# EAGLE design A131B (EAGLE 6.6.0)
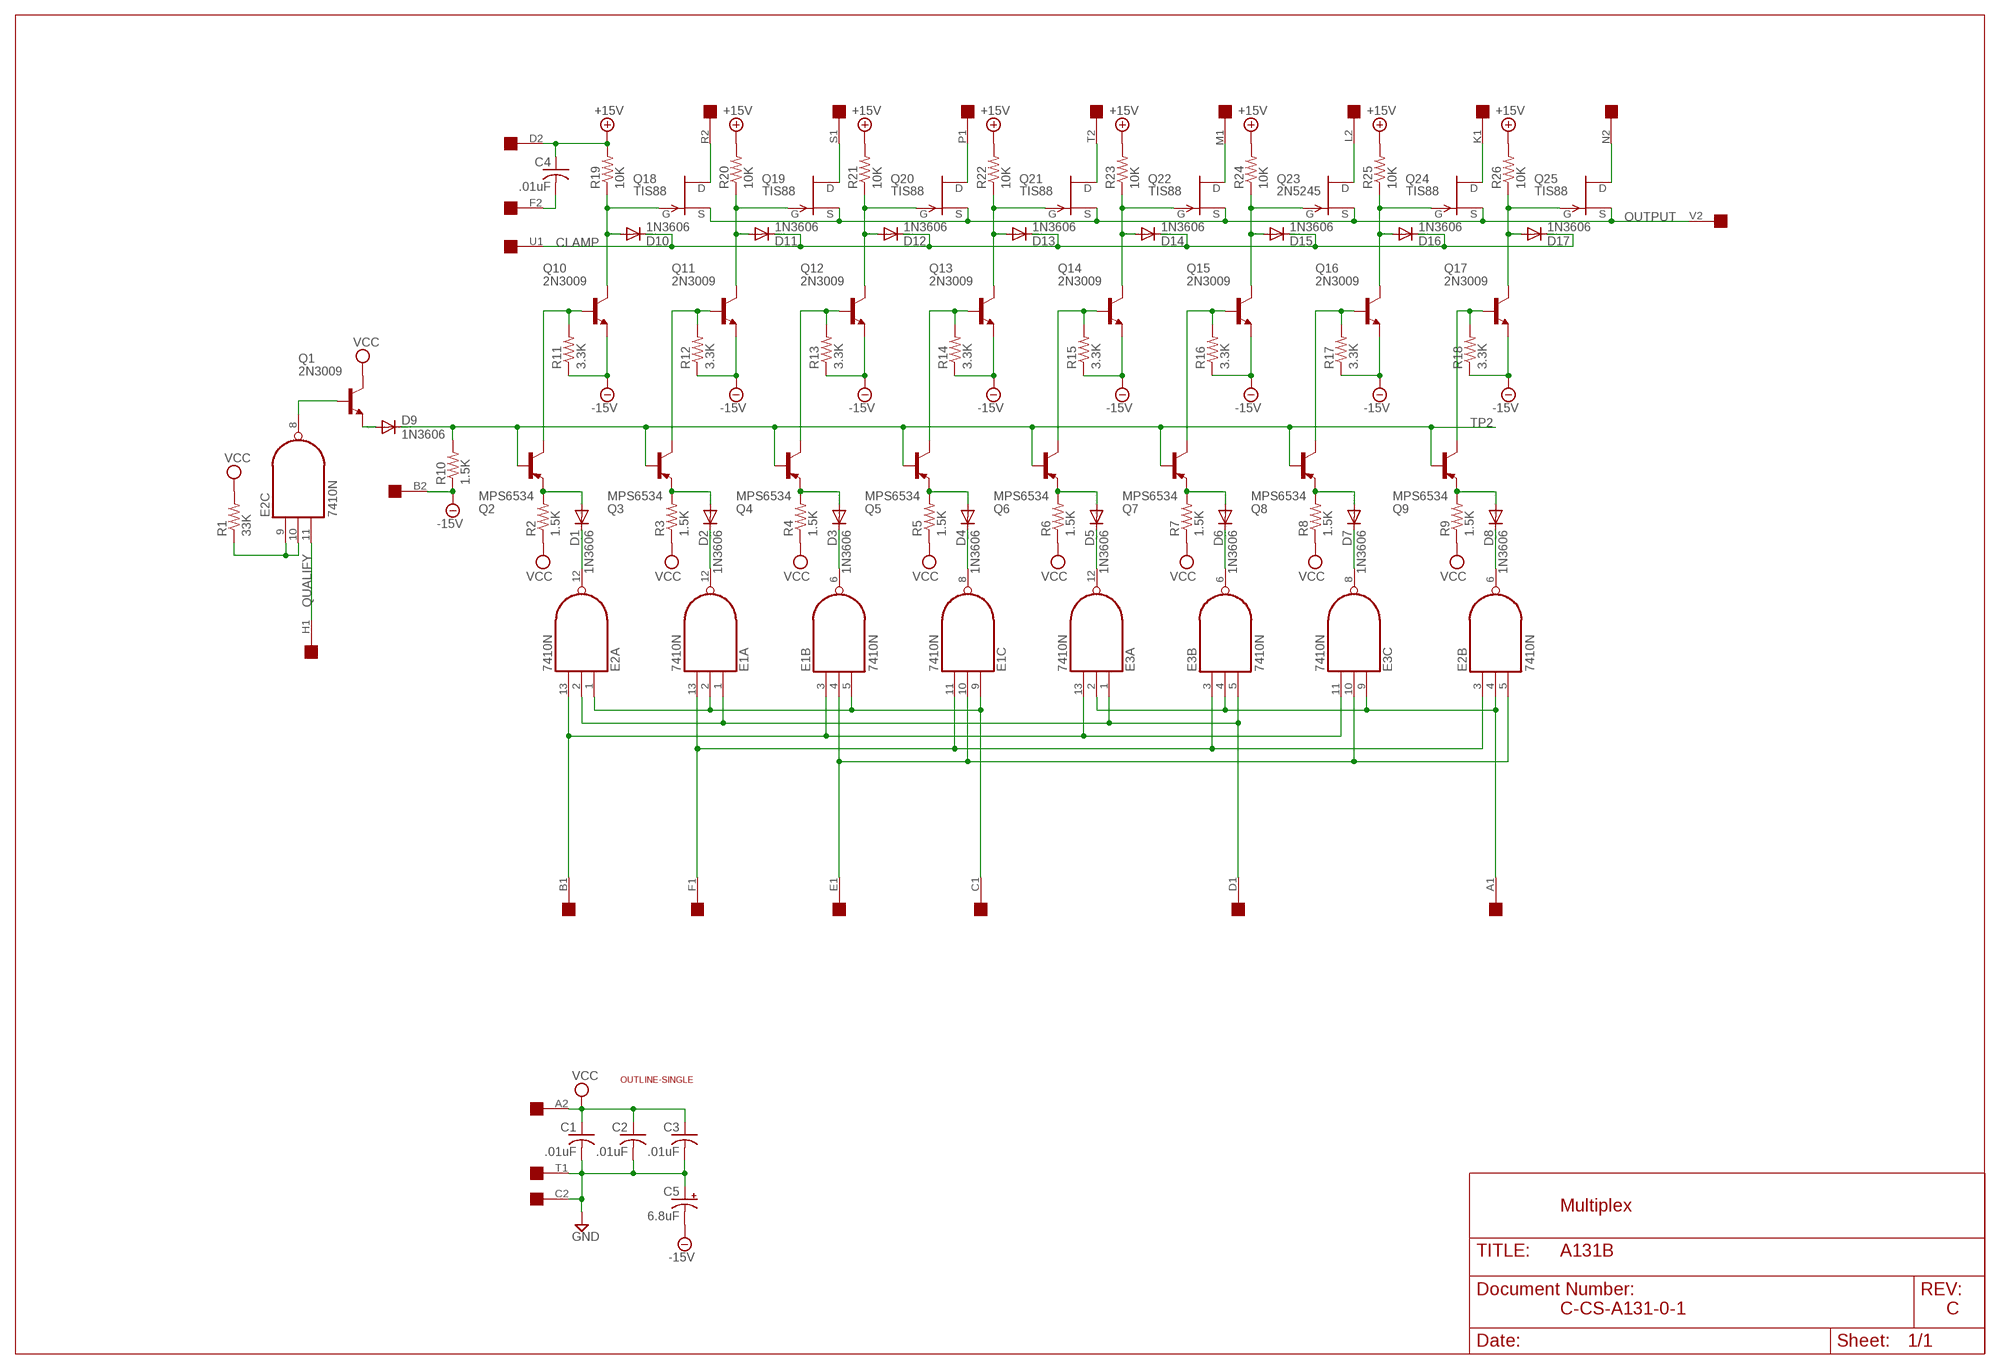
[diagram p0: schematic, sheet 1]

## Parts
C1  .01uF  C-US050-025X075  [C050-025X075]
C2  .01uF  C-US050-025X075  [C050-025X075]
C3  .01uF  C-US050-025X075  [C050-025X075]
C4  .01uF  C-US050-025X075  [C050-025X075]
C5  6.8uF  CPOL-USE20-8AXIAL  [E12-8]
D1  1N3606  DIODE-DO35-10  [DO35-10]
D2  1N3606  DIODE-DO35-10  [DO35-10]
D3  1N3606  DIODE-DO35-10  [DO35-10]
D4  1N3606  DIODE-DO35-10  [DO35-10]
D5  1N3606  DIODE-DO35-10  [DO35-10]
D6  1N3606  DIODE-DO35-10  [DO35-10]
D7  1N3606  DIODE-DO35-10  [DO35-10]
D8  1N3606  DIODE-DO35-10  [DO35-10]
D9  1N3606  DIODE-DO35-10  [DO35-10]
D10  1N3606  DIODE-DO35-10  [DO35-10]
D11  1N3606  DIODE-DO35-10  [DO35-10]
D12  1N3606  DIODE-DO35-10  [DO35-10]
D13  1N3606  DIODE-DO35-10  [DO35-10]
D14  1N3606  DIODE-DO35-10  [DO35-10]
D15  1N3606  DIODE-DO35-10  [DO35-10]
D16  1N3606  DIODE-DO35-10  [DO35-10]
D17  1N3606  DIODE-DO35-10  [DO35-10]
E1  7410N  [DIL14]
E2  7410N  [DIL14]
E3  7410N  [DIL14]
Q1  2N3009  -NPN-TO5  [TO5]
Q2  MPS6534  -PNP-TO5  [TO5]
Q3  MPS6534  -PNP-TO5  [TO5]
Q4  MPS6534  -PNP-TO5  [TO5]
Q5  MPS6534  -PNP-TO5  [TO5]
Q6  MPS6534  -PNP-TO5  [TO5]
Q7  MPS6534  -PNP-TO5  [TO5]
Q8  MPS6534  -PNP-TO5  [TO5]
Q9  MPS6534  -PNP-TO5  [TO5]
Q10  2N3009  -NPN-TO5  [TO5]
Q11  2N3009  -NPN-TO5  [TO5]
Q12  2N3009  -NPN-TO5  [TO5]
Q13  2N3009  -NPN-TO5  [TO5]
Q14  2N3009  -NPN-TO5  [TO5]
Q15  2N3009  -NPN-TO5  [TO5]
Q16  2N3009  -NPN-TO5  [TO5]
Q17  2N3009  -NPN-TO5  [TO5]
Q18  TIS88  [TO39]
Q19  TIS88  [TO39]
Q20  TIS88  [TO39]
Q21  TIS88  [TO39]
Q22  TIS88  [TO39]
Q23  2N5245  TIS88  [TO39]
Q24  TIS88  [TO39]
Q25  TIS88  [TO39]
R1  33K  R-US_0207/10  [0207/10]
R2  1.5K  R-US_0207/10  [0207/10]
R3  1.5K  R-US_0207/10  [0207/10]
R4  1.5K  R-US_0207/10  [0207/10]
R5  1.5K  R-US_0207/10  [0207/10]
R6  1.5K  R-US_0207/10  [0207/10]
R7  1.5K  R-US_0207/10  [0207/10]
R8  1.5K  R-US_0207/10  [0207/10]
R9  1.5K  R-US_0207/10  [0207/10]
R10  1.5K  R-US_0207/10  [0207/10]
R11  3.3K  R-US_0207/10  [0207/10]
R12  3.3K  R-US_0207/10  [0207/10]
R13  3.3K  R-US_0207/10  [0207/10]
R14  3.3K  R-US_0207/10  [0207/10]
R15  3.3K  R-US_0207/10  [0207/10]
R16  3.3K  R-US_0207/10  [0207/10]
R17  3.3K  R-US_0207/10  [0207/10]
R18  3.3K  R-US_0207/10  [0207/10]
R19  10K  R-US_0207/10  [0207/10]
R20  10K  R-US_0207/10  [0207/10]
R21  10K  R-US_0207/10  [0207/10]
R22  10K  R-US_0207/10  [0207/10]
R23  10K  R-US_0207/10  [0207/10]
R24  10K  R-US_0207/10  [0207/10]
R25  10K  R-US_0207/10  [0207/10]
R26  10K  R-US_0207/10  [0207/10]
U$1  OUTLINE-SINGLE  [SINGLE]
U$2  SINGLE  [EDGE-CON2]

## Nets
+15V [supply]: C4.1 R19.2 R20.2 R21.2 R22.2 R23.2 R24.2 R25.2 R26.2 U$2.D2
-15V [supply]: C5.- Q10.1(E) Q11.1(E) Q12.1(E) Q13.1(E) Q14.1(E) Q15.1(E) Q16.1(E) Q17.1(E) R10.1 R11.1 R12.1 R13.1 R14.1 R15.1 R16.1 R17.1 R18.1 U$2.B2
CLAMP [supply]: D10.C D11.C D12.C D13.C D14.C D15.C D16.C D17.C U$2.U1
GND [supply]: C1.2 C2.2 C3.2 C5.+ U$2.C2 U$2.T1
N$1: E2.9(C:I0) E2.10(C:I1) R1.1
N$2: D10.A Q10.3(C) Q18.3(G) R19.1
N$4: D12.A Q12.3(C) Q20.3(G) R21.1
N$5: D13.A Q13.3(C) Q21.3(G) R22.1
N$6: D14.A Q14.3(C) Q22.3(G) R23.1
N$7: D15.A Q15.3(C) Q23.3(G) R24.1
N$8: D16.A Q16.3(C) Q24.3(G) R25.1
N$9: D17.A Q17.3(C) Q25.3(G) R26.1
N$10: Q18.2(D) U$2.R2
N$11: Q19.2(D) U$2.S1
N$12: Q20.2(D) U$2.P1
N$13: Q21.2(D) U$2.T2
N$14: Q22.2(D) U$2.M1
N$15: Q23.2(D) U$2.L2
N$16: Q24.2(D) U$2.K1
N$17: Q25.2(D) U$2.N2
N$18 [supply]: C4.2 U$2.F2
N$19: Q2.3(C) Q10.2(B) R11.2
N$20: Q3.3(C) Q11.2(B) R12.2
N$21: Q4.3(C) Q12.2(B) R13.2
N$22: Q5.3(C) Q13.2(B) R14.2
N$23: Q6.3(C) Q14.2(B) R15.2
N$24: Q9.3(C) Q17.2(B) R18.2
N$25: Q8.3(C) Q16.2(B) R17.2
N$26: Q7.3(C) Q15.2(B) R16.2
N$27: D1.A Q2.1(E) R2.2
N$28: D2.A Q3.1(E) R3.2
N$29: D3.A Q4.1(E) R4.2
N$30: D4.A Q5.1(E) R5.2
N$31: D5.A Q6.1(E) R6.2
N$32: D6.A Q7.1(E) R7.2
N$33: D7.A Q8.1(E) R8.2
N$34: D8.A Q9.1(E) R9.2
N$35: E2.8(C:O) Q1.2(B)
N$36: D9.A Q1.1(E)
N$37: D1.C E2.12(A:O)
N$38: D2.C E1.12(A:O)
N$39: D3.C E1.6(B:O)
N$40: D4.C E1.8(C:O)
N$41: D5.C E3.12(A:O)
N$42: D6.C E3.6(B:O)
N$43: D7.C E3.8(C:O)
N$44: D8.C E2.6(B:O)
N$45: E1.3(B:I0) E2.13(A:I2) E3.11(C:I2) E3.13(A:I2) U$2.B1
N$46: E1.11(C:I2) E1.13(A:I2) E2.3(B:I0) E3.3(B:I0) U$2.F1
N$47: E1.4(B:I1) E1.10(C:I1) E2.5(B:I2) E3.10(C:I1) U$2.E1
N$48: E1.2(A:I1) E1.5(B:I2) E1.9(C:I0) E2.1(A:I0) U$2.C1
N$49: D11.A Q11.3(C) Q19.3(G) R20.1
N$50: E2.4(B:I1) E3.2(A:I1) E3.4(B:I1) E3.9(C:I0) U$2.A1
N$52: E1.1(A:I0) E2.2(A:I1) E3.1(A:I0) E3.5(B:I2) U$2.D1
OUTPUT: Q18.1(S) Q19.1(S) Q20.1(S) Q21.1(S) Q22.1(S) Q23.1(S) Q24.1(S) Q25.1(S) U$2.V2
QUALIFY: E2.11(C:I2) U$2.H1
TP2: D9.C Q2.2(B) Q3.2(B) Q4.2(B) Q5.2(B) Q6.2(B) Q7.2(B) Q8.2(B) Q9.2(B) R10.2
VCC [supply]: C1.1 C2.1 C3.1 Q1.3(C) R1.2 R2.1 R3.1 R4.1 R5.1 R6.1 R7.1 R8.1 R9.1 U$2.A2
Unconnected: U$2.E2 U$2.H2 U$2.J1 U$2.J2 U$2.K2 U$2.L1 U$2.M2 U$2.N1 U$2.P2 U$2.R1 U$2.S2 U$2.U2 U$2.V1

## Notes on the sheet
- Multiplex
- C-CS-A131-0-1 | C

## Power pins joined to a net without a drawn wire
GND: E1.7(P:GND) E2.7(P:GND) E3.7(P:GND)
VCC: E1.14(P:VCC) E2.14(P:VCC) E3.14(P:VCC)

## Library data of the parts
C1-C4 = rcl:C-US: CAPACITOR, American symbol
C5 = dec-con:CPOL-USE20-8AXIAL: A 0.8 inch electrolytic.
D1-D17 = diode:DIODE-: DIODE
E1-E3 = 74xx-us:74*10: Triple 3-input NAND gate
Q1 Q10-Q17 = transistor:*-NPN-: NPN Transistror BF959 corrected 2008.03.06
Q2-Q9 = transistor:*-PNP-: PNP Transistror
Q18-Q25 = dec-con:TIS88: N-Channel JFET 30V; 15mA
R1-R26 = rcl:R-US_: RESISTOR, American symbol
U$1 = dec-con:OUTLINE-*: Board outlines for DEC boards.
U$2 = dec-con:SINGLE: Single-Height DEC board

## Net classes
1 supply: width 0.813 mm

## Board
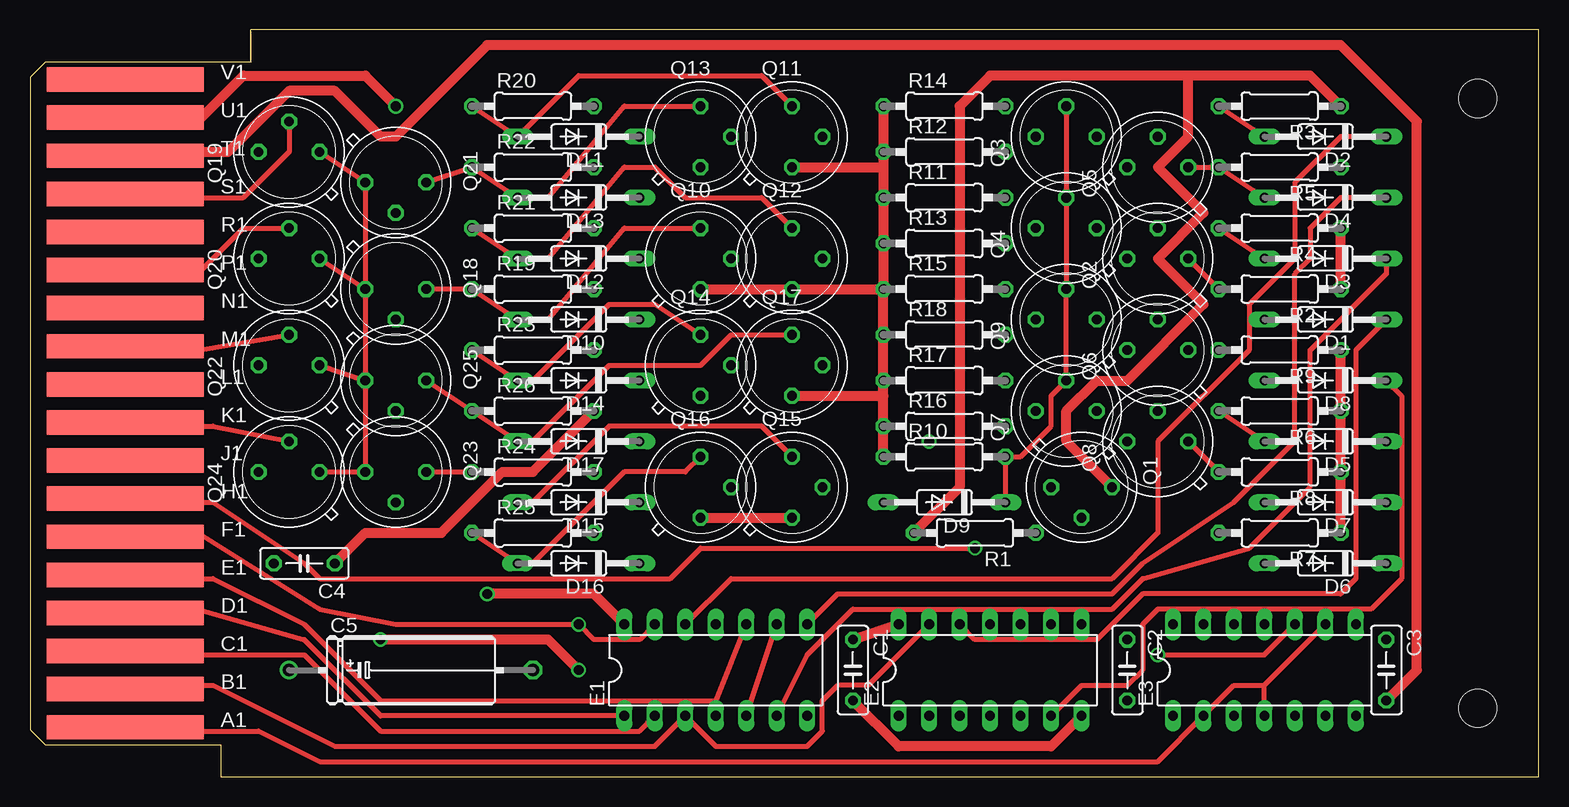
[diagram p1: board, top side]
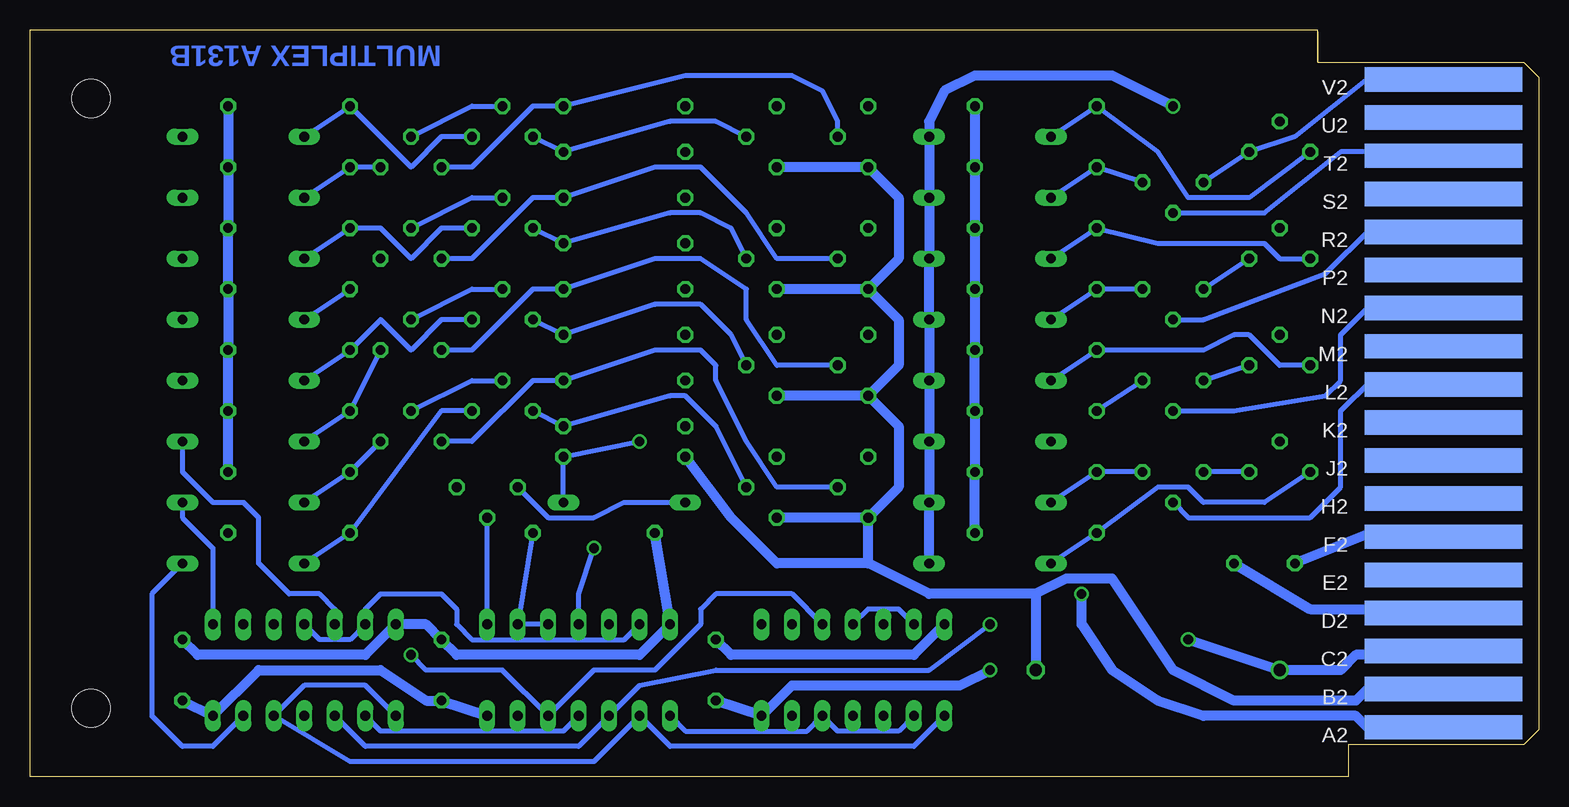
[diagram p2: board, bottom side, seen from below]

Size 125.73 x 62.23 mm. Coordinates in mm from the lower left corner, seen from the top.
Copper layers (1+16): Top 0.035mm / dielectric 1.5mm / Bottom 0.035mm
Design rules "16mils": minimum track width 16mil, minimum drill 32mil, track to track 15mil, track to pad 10mil, pad to pad 10mil, via to via 10mil, smd to smd 10mil, copper to edge 13mil, drill to drill 10mil, minimum pad ring 10mil, minimum via ring 8mil, stop-mask expansion 0mil, vias tented up to drill 0mil, thermal gap 10mil

### Footprints (pad centres in the part's own frame; a part is rotated, then mirrored left to right if it is on the bottom)
C050-025X075 = drill 0.813 octagon: 1 -2.54,0; 2 2.54,0
E12-8 = drill 1.016: + -10.16,0 | drill 1.016 octagon: - 10.16,0
DO35-10 = drill 0.813 long: A 5.08,0; C -5.08,0
DIL14 = drill 0.813 long: 1 -7.62,-3.81; 2 -5.08,-3.81; 3 -2.54,-3.81; 4 0,-3.81; 5 2.54,-3.81; 6 5.08,-3.81; 7 7.62,-3.81; 8 7.62,3.81; 9 5.08,3.81; 10 2.54,3.81; 11 0,3.81; 12 -2.54,3.81; 13 -5.08,3.81; 14 -7.62,3.81
TO5 = drill 0.813 octagon: 1 0,-2.54; 2 2.54,0; 3 0,2.54
TO39 = drill 0.813 octagon: 1 0,-2.54; 2 2.54,0; 3 0,2.54
0207/10 = drill 0.813 octagon: 1 -5.08,0; 2 5.08,0
SINGLE = hole 3.175: 120.65,56.515; 120.65,5.715
EDGE-CON2 = smd 13.106 x 2.032: A1 7.938,4.128; B1 7.938,7.303; C1 7.938,10.477; D1 7.938,13.652; E1 7.938,16.828; F1 7.938,20.003; H1 7.938,23.177; J1 7.938,26.352; K1 7.938,29.527; L1 7.938,32.703; M1 7.938,35.877; N1 7.938,39.053; P1 7.938,42.227; R1 7.938,45.403; S1 7.938,48.578; T1 7.938,51.752; U1 7.938,54.928; V1 7.938,58.102 | smd 13.106 x 2.032 bottom: A2 7.938,4.128; B2 7.938,7.303; C2 7.938,10.477; D2 7.938,13.652; E2 7.938,16.828; F2 7.938,20.003; H2 7.938,23.177; J2 7.938,26.352; K2 7.938,29.527; L2 7.938,32.703; M2 7.938,35.877; N2 7.938,39.053; P2 7.938,42.227; R2 7.938,45.403; S2 7.938,48.578; T2 7.938,51.752; U2 7.938,54.928; V2 7.938,58.102

### Placement (x,y rotation side)
C1  68.58,8.89 270 top
C2  91.44,8.89 270 top
C3  113.03,8.89 270 top
C4  22.86,17.78 180 top
C5  31.75,8.89 0 top
D1  107.95,38.1 180 top
D2  107.95,53.34 180 top
D3  107.95,43.18 180 top
D4  107.95,48.26 180 top
D5  107.95,27.94 180 top
D6  107.95,17.78 180 top
D7  107.95,22.86 180 top
D8  107.95,33.02 180 top
D9  76.2,22.86 180 top
D10  45.72,38.1 180 top
D11  45.72,53.34 180 top
D12  45.72,43.18 180 top
D13  45.72,48.26 180 top
D14  45.72,33.02 180 top
D15  45.72,22.86 180 top
D16  45.72,17.78 180 top
D17  45.72,27.94 180 top
E1  57.15,8.89 0 top
E2  80.01,8.89 0 top
E3  102.87,8.89 0 top
Q1  87.63,24.13 270 top
Q2  93.98,43.18 90 top
Q3  86.36,53.34 90 top
Q4  86.36,45.72 90 top
Q5  93.98,50.8 90 top
Q6  93.98,35.56 90 top
Q7  86.36,30.48 90 top
Q8  93.98,27.94 90 top
Q9  86.36,38.1 90 top
Q10  55.88,43.18 0 top
Q11  63.5,53.34 0 top
Q12  63.5,43.18 0 top
Q13  55.88,53.34 0 top
Q14  55.88,34.29 0 top
Q15  63.5,24.13 0 top
Q16  55.88,24.13 0 top
Q17  63.5,34.29 0 top
Q18  30.48,40.64 270 top
Q19  21.59,52.07 90 top
Q20  21.59,43.18 90 top
Q21  30.48,49.53 270 top
Q22  21.59,34.29 90 top
Q23  30.48,25.4 270 top
Q24  21.59,25.4 90 top
Q25  30.48,33.02 270 top
R1  78.74,20.32 180 top
R2  104.14,40.64 180 top
R3  104.14,55.88 180 top
R4  104.14,45.72 180 top
R5  104.14,50.8 180 top
R6  104.14,30.48 180 top
R7  104.14,20.32 180 top
R8  104.14,25.4 180 top
R9  104.14,35.56 180 top
R10  76.2,26.67 0 top
R11  76.2,48.26 0 top
R12  76.2,52.07 0 top
R13  76.2,44.45 0 top
R14  76.2,55.88 0 top
R15  76.2,40.64 0 top
R16  76.2,29.21 0 top
R17  76.2,33.02 0 top
R18  76.2,36.83 0 top
R19  41.91,40.64 0 top
R20  41.91,55.88 0 top
R21  41.91,45.72 0 top
R22  41.91,50.8 0 top
R23  41.91,35.56 0 top
R24  41.91,25.4 0 top
R25  41.91,20.32 0 top
R26  41.91,30.48 0 top
U$1  0,0 0 top
U$2  0,0 0 top

### Tracks (layer width: path | path; a pad name or v marks a point on that pad's centre or on a via)
+15V
  Top 0.813: C4.1 27.94,20.32 34.29,20.32 39.37,25.4 41.91,25.4 R26.2
  Bottom 0.813: C4.1 19.05,13.97 8.89,13.97 U$2.D2 | R20.2 R22.2 R21.2 R19.2 R23.2 R26.2 R24.2 R25.2
-15V
  Top 0.813: R14.1 R12.1 71.12,50.8 | 71.12,50.8 R11.1 R13.1 R15.1 | 71.12,31.75 R16.1 R10.1 | 71.12,31.75 R17.1 R18.1 R15.1 | Q16.1 Q15.1 | Q10.1 Q12.1 R15.1 | Q11.1 71.12,50.8 | Q17.1 71.12,31.75
  Bottom 0.813: U$2.B2 10.16,7.3 10.16,7.62 13.97,7.62 15.24,6.35 25.4,6.35 30.48,8.89 35.56,16.51 39.37,16.51 41.91,15.24 | 41.91,15.24 C5.- | Q14.1 Q17.1 | Q16.1 Q15.1 | Q10.1 Q12.1 | Q11.1 Q13.1 53.34,48.26 53.34,43.18 Q10.1 | Q10.1 53.34,38.1 53.34,34.29 Q14.1 | Q14.1 53.34,29.21 53.34,24.13 Q16.1 | 41.91,15.24 50.8,15.24 55.88,17.78 | 55.88,17.78 Q16.1 | 55.88,17.78 63.5,17.78 67.31,21.59 R10.1
CLAMP  (via drill 0.81)
  Top 0.813: U$2.U1 10.16,54.61 13.97,54.61 17.78,58.42 27.94,58.42 v30.48,55.88
  Bottom 0.813: v30.48,55.88 35.56,58.42 46.99,58.42 49.53,57.15 50.8,54.61 D11.C D13.C D12.C D10.C D14.C D17.C D15.C D16.C
GND  (via drill 0.81)
  Top 0.813: C3.2 115.57,8.89 115.57,54.61 109.22,60.96 38.1,60.96 30.48,53.34 29.21,53.34 25.4,57.15 21.59,57.15 16.51,52.07 8.89,52.07 U$2.T1 | v45.72,8.89 43.18,11.43 v29.21,11.43 | E2.7 85.09,2.54 72.39,2.54 C1.2
  Bottom 0.813: U$2.C2 8.89,10.16 15.24,10.16 16.51,8.89 C5.+ v29.21,11.43 | C1.2 E1.7 62.23,7.62 48.26,7.62 v45.72,8.89 | C3.2 E3.7 106.68,8.89 96.52,8.89 92.71,6.35 C2.2 E2.7
N$1
  Bottom 0.406: R1.1 E2.9 E2.10
N$2
  Top 0.406: Q18.3 R19.1 D10.A 43.18,38.1 49.53,45.72 Q10.3
  Bottom 0.406: D10.A R19.1 Q18.3
N$4
  Top 0.406: R21.1 D12.A 43.18,43.18 49.53,50.8 52.07,50.8 54.61,48.26 60.96,48.26 Q12.3
  Bottom 0.406: D12.A R21.1 31.75,44.45 22.86,44.45 21.59,43.18 Q20.3
N$5
  Top 0.406: Q21.3 R22.1 D13.A 43.18,48.26 49.53,55.88 Q13.3
  Bottom 0.406: D13.A R22.1 Q21.3
N$6
  Top 0.406: R23.1 D14.A 41.91,33.02 48.26,39.37 52.07,39.37 Q14.3
  Bottom 0.406: D14.A R23.1 27.94,35.56 25.4,36.83 24.13,36.83 21.59,34.29 Q22.3
N$7
  Top 0.406: Q23.3 R24.1 | D15.A 41.91,22.86 48.26,29.21 60.96,29.21 Q15.3
  Bottom 0.406: D15.A R24.1 Q23.3
N$8
  Top 0.406: R25.1 D16.A 41.91,17.78 49.53,25.4 54.61,25.4 Q16.3
  Bottom 0.406: D16.A R25.1 31.75,24.13 29.21,24.13 27.94,22.86 22.86,22.86 Q24.3
N$9
  Top 0.406: Q25.3 R26.1 D17.A 41.91,27.94 48.26,34.29 55.88,34.29 58.42,36.83 Q17.3
  Bottom 0.406: Q25.3 R26.1
N$10
  Bottom 0.406: Q18.2 27.94,38.1 17.78,41.91 13.97,45.72 8.89,45.72 U$2.R2
N$11
  Top 0.406: U$2.S1 8.89,48.26 17.78,48.26 21.59,52.07 Q19.2
N$12
  Top 0.406: U$2.P1 8.89,41.91 13.97,41.91 17.78,45.72 Q20.2
N$13
  Bottom 0.406: Q21.2 22.86,46.99 16.51,52.07 8.89,52.07 U$2.T2
N$14
  Top 0.406: U$2.M1 7.62,35.56 13.97,35.56 Q22.2
N$15
  Bottom 0.406: Q23.2 29.21,21.59 19.05,21.59 16.51,24.13 16.51,30.48 13.97,33.02 8.89,33.02 U$2.L2
N$16
  Top 0.406: U$2.K1 8.89,29.21 15.24,29.21 Q24.2
N$17
  Bottom 0.406: Q25.2 25.4,30.48 17.78,31.75 16.51,33.02 16.51,36.83 13.97,39.37 8.89,39.37 U$2.N2
N$18
  Bottom 0.813: U$2.F2 10.16,20.32 13.97,20.32 C4.2
N$19
  Bottom 0.406: Q10.2 63.5,43.18 66.04,46.99 69.85,50.8 73.66,50.8 R11.2 83.82,48.26 88.9,43.18 Q2.3
N$20
  Bottom 0.406: Q11.2 68.58,54.61 72.39,54.61 R12.2 Q3.3
N$21
  Bottom 0.406: Q12.2 67.31,45.72 69.85,46.99 72.39,46.99 R13.2 Q4.3
N$22
  Bottom 0.406: Q13.2 58.42,54.61 59.69,57.15 62.23,58.42 71.12,58.42 R14.2 83.82,55.88 88.9,50.8 Q5.3
N$23
  Bottom 0.406: Q14.2 63.5,34.29 66.04,38.1 66.04,40.64 69.85,43.18 73.66,43.18 R15.2 83.82,40.64 88.9,35.56 Q6.3
N$24
  Bottom 0.406: Q17.2 67.31,36.83 69.85,39.37 73.66,39.37 R18.2 Q9.3
N$25
  Bottom 0.406: Q16.2 63.5,24.13 66.04,27.94 68.58,33.02 68.58,34.29 69.85,35.56 73.66,35.56 R17.2 83.82,33.02 88.9,27.94 Q8.3
N$26
  Bottom 0.406: Q15.2 68.58,29.21 71.12,31.75 72.39,31.75 R16.2 Q7.3
N$27
  Top 0.406: Q2.1 R2.2
  Bottom 0.406: D1.A R2.2
N$28
  Top 0.406: R3.2 D2.A
  Bottom 0.406: D2.A R3.2 93.98,50.8 91.44,53.34 Q3.1
N$29
  Top 0.406: R4.2 D3.A
  Bottom 0.406: D3.A R4.2 96.52,45.72 93.98,43.18 91.44,45.72 Q4.1
N$30
  Top 0.406: D4.A R5.2 Q5.1
  Bottom 0.406: D4.A R5.2 Q5.1
N$31
  Top 0.406: R6.2 D5.A
  Bottom 0.406: D5.A R6.2 Q6.1
N$32
  Bottom 0.406: D6.A R7.2 91.44,30.48 Q7.1
N$33
  Top 0.406: Q8.1 R8.2
  Bottom 0.406: D7.A R8.2 Q8.1
N$34
  Bottom 0.406: D8.A R9.2 96.52,38.1 93.98,35.56 91.44,38.1 Q9.1
N$35
  Bottom 0.406: E2.8 Q1.2
N$36
  Bottom 0.406: Q1.1 82.55,21.59 78.74,21.59 76.2,22.86 D9.A
N$37
  Top 0.406: D1.C 110.49,35.56 110.49,16.51 109.22,15.24 92.71,15.24 88.9,11.43 78.74,11.43 E2.12
N$38
  Top 0.406: E1.12 58.42,16.51 90.17,16.51 93.98,20.32 93.98,27.94 101.6,35.56 101.6,39.37 105.41,43.18 105.41,49.53 109.22,53.34 D2.C
N$39
  Top 0.406: E1.6 64.77,10.16 68.58,13.97 90.17,13.97 92.71,16.51 101.6,19.05 106.68,24.13 106.68,35.56 113.03,41.91 D3.C
N$40
  Top 0.406: E1.8 67.31,15.24 90.17,15.24 92.71,17.78 100.33,22.86 105.41,27.94 105.41,41.91 106.68,43.18 106.68,45.72 109.22,48.26 D4.C
N$41
  Bottom 0.406: D5.C 113.03,25.4 110.49,22.86 107.95,22.86 106.68,21.59 106.68,17.78 104.14,15.24 101.6,15.24 100.33,13.97 E3.12
N$42
  Bottom 0.406: E3.6 110.49,2.54 113.03,2.54 115.57,5.08 115.57,15.24 D6.C
N$43
  Bottom 0.406: D7.C 113.03,21.59 110.49,19.05 E3.8
N$44
  Top 0.406: D8.C 114.3,31.75 114.3,16.51 111.76,13.97 93.98,13.97 92.71,12.7 92.71,8.89 91.44,7.62 87.63,7.62 E2.6
N$45
  Top 0.406: U$2.B1 8.89,7.3 8.89,7.62 15.24,7.62 25.4,2.54 52.07,2.54 E1.3 57.15,2.54 64.77,2.54 66.04,3.81 66.04,6.35 67.31,7.62 69.85,7.62 E2.13
  Bottom 0.406: E3.11 101.6,11.43 99.06,11.43 E3.13 97.79,13.97 96.52,15.24 91.44,15.24 90.17,13.97 90.17,12.7 88.9,11.43 76.2,11.43 E2.13
N$46  (via drill 0.81)
  Top 0.406: U$2.F1 8.89,20.32 13.97,20.32 24.13,13.97 30.48,12.7 v45.72,12.7 46.99,11.43 50.8,11.43 E1.13
  Bottom 0.406: E1.13 53.34,13.97 55.88,13.97 E1.11 | E3.3 97.79,2.54 80.01,2.54 E2.3 74.93,7.62 68.58,8.89 50.8,8.89 v45.72,12.7
N$47  (via drill 0.81)
  Top 0.406: U$2.E1 8.89,16.51 15.24,16.51 22.86,12.7 29.21,6.35 57.15,6.35 | 57.15,6.35 E1.4 | E1.10 57.15,6.35 | v93.98,10.16 102.87,10.16 E3.10
  Bottom 0.406: E1.10 62.23,15.24 68.58,15.24 69.85,13.97 69.85,12.7 73.66,8.89 78.74,8.89 E2.5 86.36,8.89 92.71,8.89 v93.98,10.16
N$48
  Top 0.406: U$2.C1 8.89,10.16 22.86,10.16 29.21,3.81 50.8,3.81 E1.2 | E1.5 E1.9
  Bottom 0.406: E1.2 53.34,3.81 58.42,3.81 E1.5 60.96,3.81 71.12,3.81 E2.1
N$49
  Top 0.406: R20.1 D11.A 45.72,58.42 60.96,58.42 Q11.3
  Bottom 0.406: D11.A R20.1 31.75,52.07 29.21,48.26 24.13,48.26 Q19.3
N$50
  Top 0.406: U$2.A1 8.89,3.81 19.05,3.81 24.13,1.27 93.98,1.27 E3.2 100.33,7.62 102.87,7.62 | 102.87,7.62 E3.9 | E3.4 102.87,7.62
  Bottom 0.406: E2.4 81.28,3.81 96.52,3.81 E3.2
N$52
  Top 0.406: U$2.D1 8.89,13.97 13.97,13.97 22.86,11.43 29.21,5.08 E1.1
  Bottom 0.406: E1.1 52.07,2.54 72.39,2.54 E2.2 78.74,1.27 99.06,1.27 E3.5 102.87,7.62 97.79,7.62 E3.1
OUTPUT
  Top 0.406: Q25.1 Q23.1 Q24.1 | Q19.1 Q21.1 Q18.1 | Q20.1 Q18.1 | Q22.1 Q25.1 | Q18.1 Q25.1
  Bottom 0.406: U$2.V2 8.89,58.42 13.97,58.42 20.32,53.34 Q19.1 Q21.1 | Q24.1 Q23.1 | Q22.1 Q25.1 | Q20.1 Q18.1
QUALIFY  (via drill 0.81)
  Top 0.406: U$2.H1 8.89,22.86 15.24,22.86 22.86,17.78 24.13,16.51 53.34,16.51 55.88,19.05 v78.74,19.05
  Bottom 0.406: E2.11 80.01,15.24 v78.74,19.05
TP2  (via drill 0.81)
  Top 0.406: D9.C R10.2 82.55,26.67 85.09,29.21 85.09,31.75 Q7.2 Q9.2 Q4.2 Q3.2
  Bottom 0.406: D9.C R10.2 v74.93,27.94 | Q4.2 88.9,48.26 Q2.2 | Q8.2 88.9,33.02 Q7.2 | Q5.2 88.9,55.88 Q3.2 | Q6.2 88.9,40.64 Q9.2
VCC  (via drill 0.81)
  Top 0.813: E2.14 C1.1 | 96.52,58.42 106.68,58.42 R3.1 | 96.52,58.42 80.01,58.42 77.47,55.88 77.47,24.13 R1.2 | Q1.3 86.36,27.94 86.36,30.48 88.9,33.02 91.44,33.02 97.79,39.37 93.98,43.18 97.79,46.99 93.98,50.8 96.52,53.34 96.52,58.42 | E1.14 46.99,15.24 v38.1,15.24 | R2.1 R4.1 | R7.1 R8.1 R6.1 R9.1
  Bottom 0.813: U$2.A2 8.89,3.81 13.97,3.81 15.24,5.08 27.94,5.08 31.75,6.35 35.56,8.89 38.1,12.7 v38.1,15.24 | E1.14 52.07,10.16 67.31,10.16 C1.1 | R1.2 E2.14 74.93,10.16 90.17,10.16 C2.1 92.71,12.7 E3.14 97.79,10.16 111.76,10.16 C3.1 | R3.1 R5.1 R4.1 R2.1 R9.1 R6.1 R8.1

### Text on the board
Bottom: MULTIPLEX A131B